# EAGLE design PhasedArray3 (EAGLE 9.5.2)
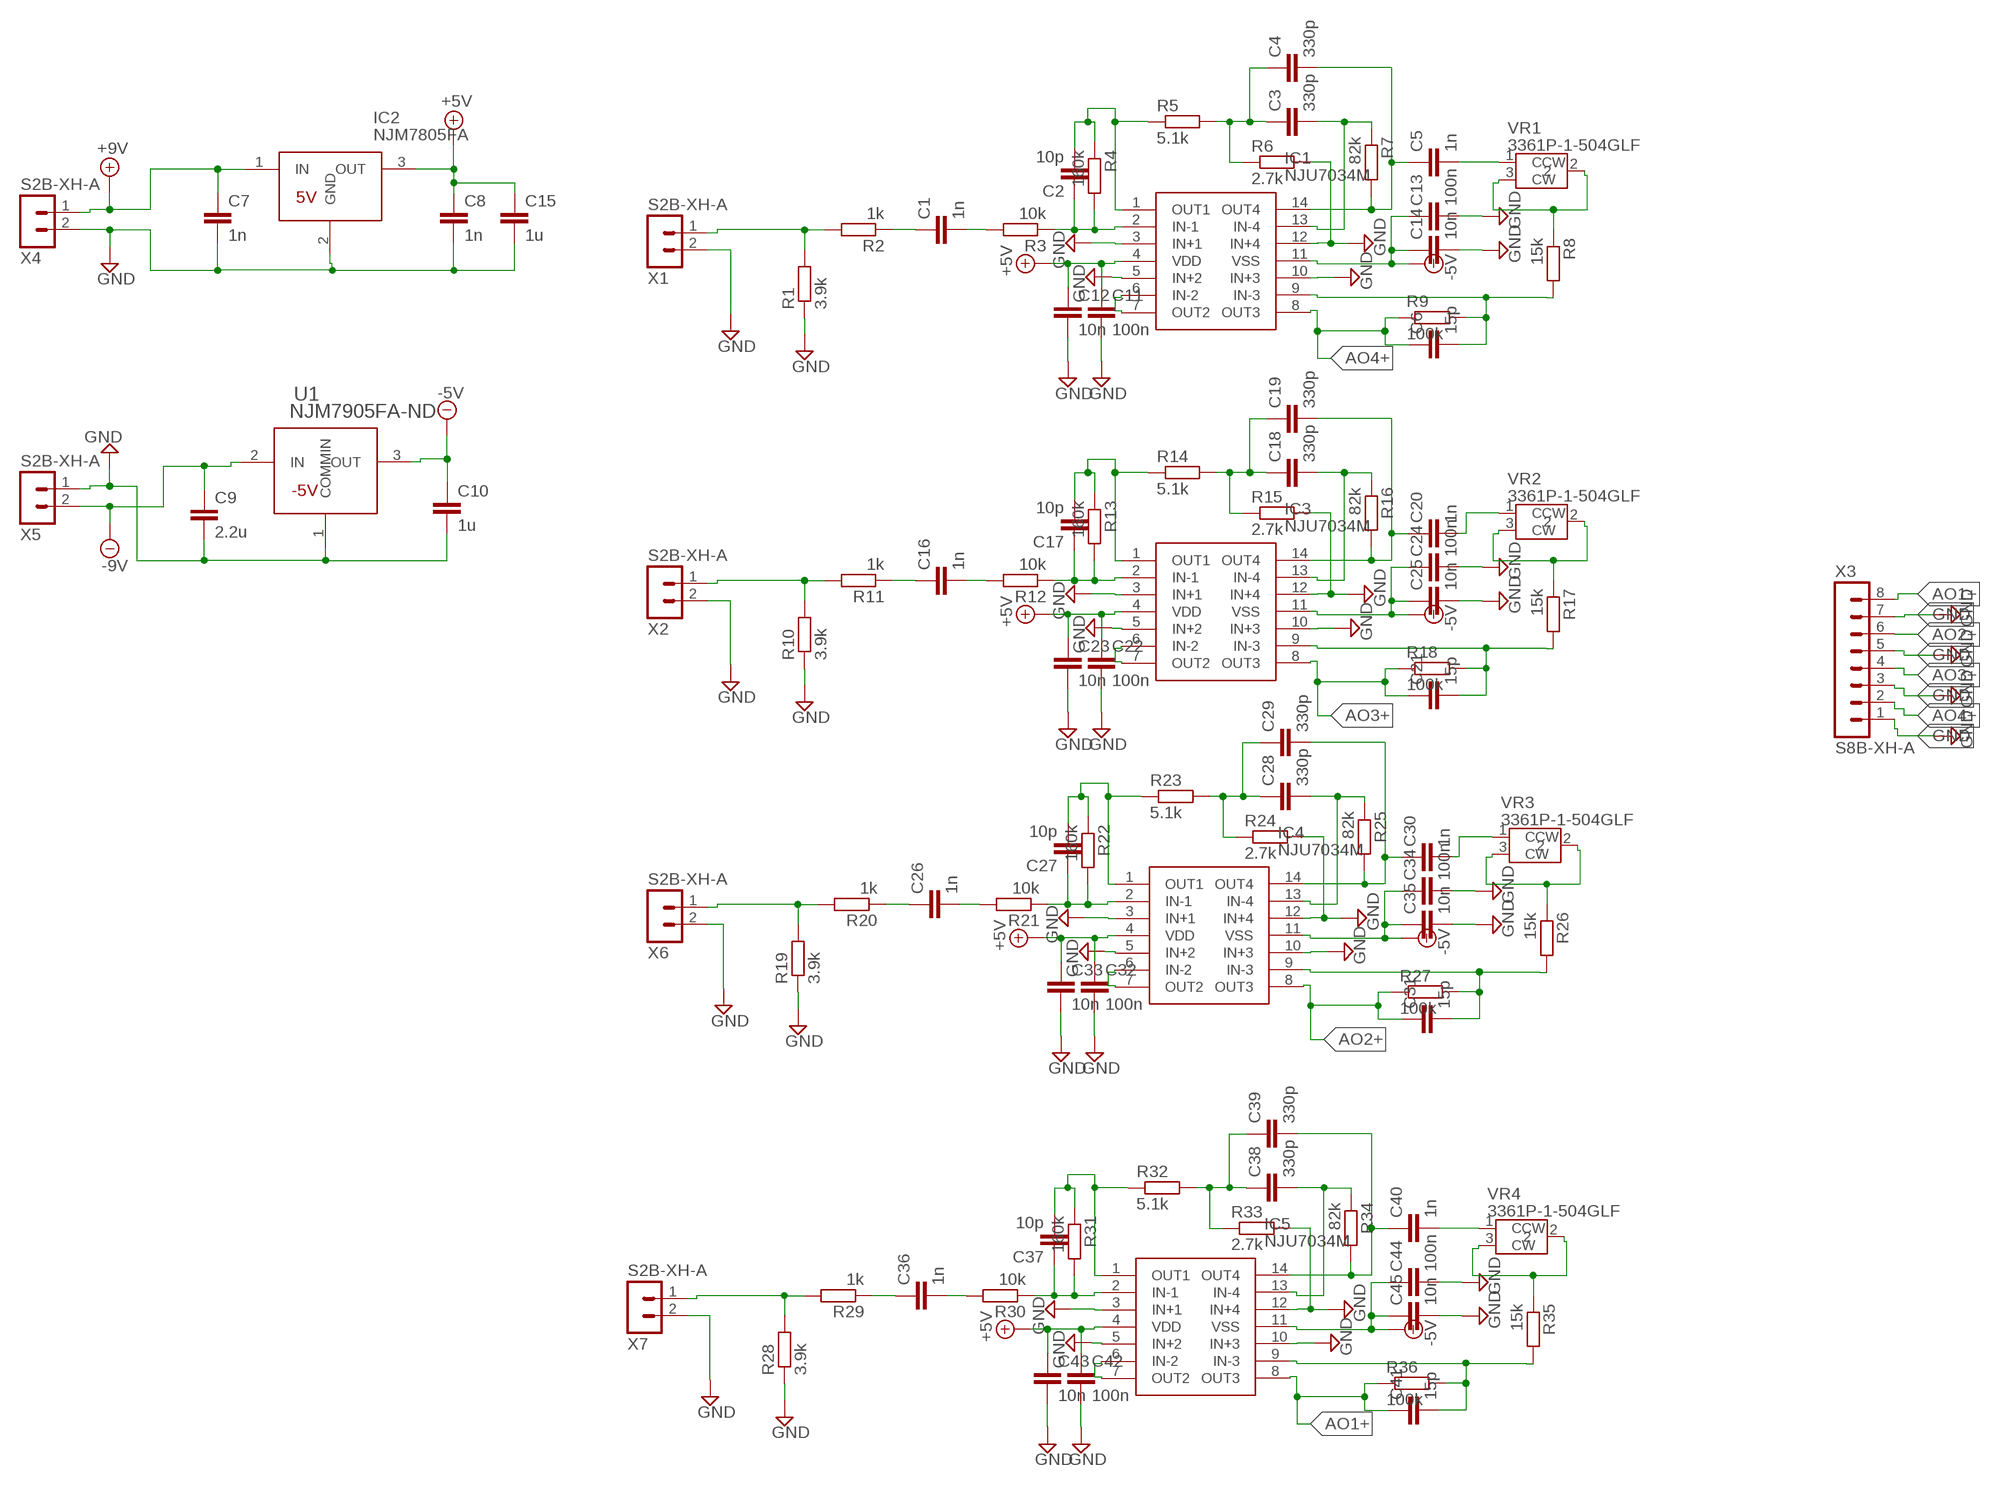
[diagram p0: schematic, sheet 1]

## Parts
C1  1n  C-EUC0603K  [C0603K]
C2  10p  C-EUC0603K  [C0603K]
C3  330p  C-EUC0603K  [C0603K]
C4  330p  C-EUC0603K  [C0603K]
C5  1n  C-EUC0603K  [C0603K]
C6  15p  C-EUC0603K  [C0603K]
C7  1n  C-EUC0603K  [C0603K]
C8  1n  C-EUC0603K  [C0603K]
C9  2.2u  C-EUC0805K  [C0805K]
C10  1u  C-EUC0805K  [C0805K]
C11  100n  C-EUC0603K  [C0603K]
C12  10n  C-EUC0603K  [C0603K]
C13  100n  C-EUC0603K  [C0603K]
C14  10n  C-EUC0603K  [C0603K]
C15  1u  C-EUC0805K  [C0805K]
C16  1n  C-EUC0603K  [C0603K]
C17  10p  C-EUC0603K  [C0603K]
C18  330p  C-EUC0603K  [C0603K]
C19  330p  C-EUC0603K  [C0603K]
C20  1n  C-EUC0603K  [C0603K]
C21  15p  C-EUC0603K  [C0603K]
C22  100n  C-EUC0603K  [C0603K]
C23  10n  C-EUC0603K  [C0603K]
C24  100n  C-EUC0603K  [C0603K]
C25  10n  C-EUC0603K  [C0603K]
C26  1n  C-EUC0603K  [C0603K]
C27  10p  C-EUC0603K  [C0603K]
C28  330p  C-EUC0603K  [C0603K]
C29  330p  C-EUC0603K  [C0603K]
C30  1n  C-EUC0603K  [C0603K]
C31  15p  C-EUC0603K  [C0603K]
C32  100n  C-EUC0603K  [C0603K]
C33  10n  C-EUC0603K  [C0603K]
C34  100n  C-EUC0603K  [C0603K]
C35  10n  C-EUC0603K  [C0603K]
C36  1n  C-EUC0603K  [C0603K]
C37  10p  C-EUC0603K  [C0603K]
C38  330p  C-EUC0603K  [C0603K]
C39  330p  C-EUC0603K  [C0603K]
C40  1n  C-EUC0603K  [C0603K]
C41  15p  C-EUC0603K  [C0603K]
C42  100n  C-EUC0603K  [C0603K]
C43  10n  C-EUC0603K  [C0603K]
C44  100n  C-EUC0603K  [C0603K]
C45  10n  C-EUC0603K  [C0603K]
IC1  NJU7034M  [SOIC127P680X175-14N]
IC2  NJM7805FA  [TO254P500X1000X2170-3P]
IC3  NJU7034M  [SOIC127P680X175-14N]
IC4  NJU7034M  [SOIC127P680X175-14N]
IC5  NJU7034M  [SOIC127P680X175-14N]
R1  3.9k  R-EU_R0603  [R0603]
R2  1k  R-EU_R0603  [R0603]
R3  10k  R-EU_R0603  [R0603]
R4  160k  R-EU_R0603  [R0603]
R5  5.1k  R-EU_R0603  [R0603]
R6  2.7k  R-EU_R0603  [R0603]
R7  82k  R-EU_R0603  [R0603]
R8  15k  R-EU_R0603  [R0603]
R9  100k  R-EU_R0603  [R0603]
R10  3.9k  R-EU_R0603  [R0603]
R11  1k  R-EU_R0603  [R0603]
R12  10k  R-EU_R0603  [R0603]
R13  160k  R-EU_R0603  [R0603]
R14  5.1k  R-EU_R0603  [R0603]
R15  2.7k  R-EU_R0603  [R0603]
R16  82k  R-EU_R0603  [R0603]
R17  15k  R-EU_R0603  [R0603]
R18  100k  R-EU_R0603  [R0603]
R19  3.9k  R-EU_R0603  [R0603]
R20  1k  R-EU_R0603  [R0603]
R21  10k  R-EU_R0603  [R0603]
R22  160k  R-EU_R0603  [R0603]
R23  5.1k  R-EU_R0603  [R0603]
R24  2.7k  R-EU_R0603  [R0603]
R25  82k  R-EU_R0603  [R0603]
R26  15k  R-EU_R0603  [R0603]
R27  100k  R-EU_R0603  [R0603]
R28  3.9k  R-EU_R0603  [R0603]
R29  1k  R-EU_R0603  [R0603]
R30  10k  R-EU_R0603  [R0603]
R31  160k  R-EU_R0603  [R0603]
R32  5.1k  R-EU_R0603  [R0603]
R33  2.7k  R-EU_R0603  [R0603]
R34  82k  R-EU_R0603  [R0603]
R35  15k  R-EU_R0603  [R0603]
R36  100k  R-EU_R0603  [R0603]
U1  NJM7905FA-ND  [NJR-TO-220F-3_NJR]
VR1  3361P-1-504GLF  [3361P1253GLF]
VR2  3361P-1-504GLF  [3361P1253GLF]
VR3  3361P-1-504GLF  [3361P1253GLF]
VR4  3361P-1-504GLF  [3361P1253GLF]
X1  S2B-XH-A  [S2B-XH-A]
X2  S2B-XH-A  [S2B-XH-A]
X3  S8B-XH-A  [S8B-XH-A]
X4  S2B-XH-A  [S2B-XH-A]
X5  S2B-XH-A  [S2B-XH-A]
X6  S2B-XH-A  [S2B-XH-A]
X7  S2B-XH-A  [S2B-XH-A]

## Nets
+5V: C8.1 C11.1 C12.1 C15.1 C22.1 C23.1 C32.1 C33.1 C42.1 C43.1 IC1.4(VDD) IC2.3(OUT) IC3.4(VDD) IC4.4(VDD) IC5.4(VDD)
+9V: C7.1 IC2.1(IN) X4.1
-5V: C10.1 C13.1 C14.1 C24.1 C25.1 C34.1 C35.1 C44.1 C45.1 IC1.11(VSS) IC3.11(VSS) IC4.11(VSS) IC5.11(VSS) U1.3(OUT)
-9V: C9.1 U1.2(IN) X5.2
AO1+: C41.1 IC5.8(OUT3) R36.1 X3.8
AO2+: C31.1 IC4.8(OUT3) R27.1 X3.6
AO3+: C21.1 IC3.8(OUT3) R18.1 X3.4
AO4+: C6.1 IC1.8(OUT3) R9.1 X3.2
GND: C7.2 C8.2 C9.2 C10.2 C11.2 C12.2 C13.2 C14.2 C15.2 C22.2 C23.2 C24.2 C25.2 C32.2 C33.2 C34.2 C35.2 C42.2 C43.2 C44.2 C45.2 IC1.3(IN+1) IC1.5(IN+2) IC1.10(IN+3) IC1.12(IN+4) IC2.2(GND) IC3.3(IN+1) IC3.5(IN+2) IC3.10(IN+3) IC3.12(IN+4) IC4.3(IN+1) IC4.5(IN+2) IC4.10(IN+3) IC4.12(IN+4) IC5.3(IN+1) IC5.5(IN+2) IC5.10(IN+3) IC5.12(IN+4) R1.1 R6.2 R10.1 R15.2 R19.1 R24.2 R28.1 R33.2 U1.1(COMMIN) X1.2 X2.2 X3.1 X3.3 X3.5 X3.7 X4.2 X5.1 X6.2 X7.2
N$1: R1.2 R2.2 X1.1
N$2: C1.1 R2.1
N$3: C2.2 IC1.1(OUT1) R4.1 R5.1
N$4: C1.2 R3.2
N$5: C2.1 IC1.2(IN-1) R3.1 R4.2
N$6: C3.1 C4.1 R5.2 R6.1
N$7: C4.2 C5.1 IC1.14(OUT4) R7.2
N$8: C3.2 IC1.13(IN-4) R7.1
N$10: C5.2 VR1.1(CCW)
N$11: C6.2 IC1.9(IN-3) R8.2 R9.2
N$12: R8.1 VR1.2 VR1.3(CW)
N$13: IC1.6(IN-2) IC1.7(OUT2)
N$14: R10.2 R11.2 X2.1
N$15: C16.1 R11.1
N$16: C16.2 R12.2
N$17: C17.1 IC3.2(IN-1) R12.1 R13.2
N$18: C17.2 IC3.1(OUT1) R13.1 R14.1
N$19: C18.1 C19.1 R14.2 R15.1
N$20: C18.2 IC3.13(IN-4) R16.1
N$21: C19.2 C20.1 IC3.14(OUT4) R16.2
N$22: C21.2 IC3.9(IN-3) R17.2 R18.2
N$24: C20.2 VR2.1(CCW)
N$25: R17.1 VR2.2 VR2.3(CW)
N$26: IC3.6(IN-2) IC3.7(OUT2)
N$27: R19.2 R20.2 X6.1
N$28: C26.1 R20.1
N$29: C26.2 R21.2
N$30: C27.1 IC4.2(IN-1) R21.1 R22.2
N$31: C27.2 IC4.1(OUT1) R22.1 R23.1
N$32: C28.1 C29.1 R23.2 R24.1
N$33: C28.2 IC4.13(IN-4) R25.1
N$34: C29.2 C30.1 IC4.14(OUT4) R25.2
N$35: C31.2 IC4.9(IN-3) R26.2 R27.2
N$37: C30.2 VR3.1(CCW)
N$38: R26.1 VR3.2 VR3.3(CW)
N$39: IC4.6(IN-2) IC4.7(OUT2)
N$40: R28.2 R29.2 X7.1
N$41: C36.1 R29.1
N$42: C36.2 R30.2
N$43: C37.1 IC5.2(IN-1) R30.1 R31.2
N$44: C37.2 IC5.1(OUT1) R31.1 R32.1
N$45: C38.1 C39.1 R32.2 R33.1
N$46: C38.2 IC5.13(IN-4) R34.1
N$47: C39.2 C40.1 IC5.14(OUT4) R34.2
N$48: C41.2 IC5.9(IN-3) R35.2 R36.2
N$50: C40.2 VR4.1(CCW)
N$51: R35.1 VR4.2 VR4.3(CW)
N$52: IC5.6(IN-2) IC5.7(OUT2)

## Library data of the parts
C1-C45 = rcl:C-EU: CAPACITOR, European symbol; SPICEPREFIX: C
IC1 IC3-IC5 = SamacSys_Parts:NJU7034M: General Purpose Amplifier 4 Circuit Rail-to-Rail 14-DMP Source: Datasheet <http://www.njr.com/semicon/PDF/NJU7031_NJU7032_NJU7034_E.pdf>; DESCRIPTION: General Purpose Amplifier 4 Circuit Rail-to-Rail 14-DMP; HEIGHT: 1.75mm; MANUFACTURER_NAME: New Japan Radio; MANUFACTURER_PART_NUMBER: NJU7034M; MOUSER_PART_NUMBER: 513-NJU7034M; MOUSER_PRICE-STOCK: https://www.mouser.co.uk/ProductDetail/NJR/NJU7034M?qs=h19x94Mol3yfUbOiRzvEIQ%3D%3D
IC2 = NJM7805FA:NJM7805FA: Linear Voltage Regulators 5V 1.5A 3 Terminal Source: Datasheet <http://www.njr.com/semicon/PDF/NJM7800_E.pdf>; DESCRIPTION: Linear Voltage Regulators 5V 1.5A 3 Terminal; HEIGHT: 5mm; MANUFACTURER_NAME: NJR; MANUFACTURER_PART_NUMBER: NJM7805FA; MOUSER_PART_NUMBER: 513-NJM7805FA; MOUSER_PRICE-STOCK: https://www.mouser.co.uk/ProductDetail/NJR/NJM7805FA?qs=Z22AoiKME3MfSV1RpQcPCA%3D%3D
R1-R36 = rcl:R-EU_: RESISTOR, European symbol; SPICEPREFIX: R
U1 = NJM7905FA:NJM7905FA-ND; BUILT_BY: EMA_UL_Team; MANUFACTURER_PART_NUMBER: NJM7905FA-ND; SOURCELIBRARY: NJR_2014-15-09; VENDOR: NJR
VR1-VR4 = 3361P-1-504GLF:3361P-1-504GLF: BOURNS - 3361P-1-504GLF - Product Range:AEC-Q200 3361P Series Source: Datasheet <https://www.bourns.com/docs/Product-Datasheets/3361.pdf>; DESCRIPTION: BOURNS - 3361P-1-504GLF - Product Range:AEC-Q200 3361P Series; HEIGHT: 5.84mm; MANUFACTURER_NAME: Bourns; MANUFACTURER_PART_NUMBER: 3361P-1-504GLF; MOUSER_PART_NUMBER: 652-3361P-1-504GLF; MOUSER_PRICE-STOCK: https://www.mouser.co.uk/ProductDetail/Bourns/3361P-1-504GLF?qs=fqIB%2FsSTfTaKxcvNNIdl2Q%3D%3D
X1 X2 X4-X7 = con-JST XH:S2B-XH: JST XH series header 2.50mm pitch disconnectable crimp style connectors, horizontal (side entry type), 2 pins
X3 = con-JST XH:S8B-XH: JST XH series header 2.50mm pitch disconnectable crimp style connectors, horizontal (side entry type), 8 pins

## Net classes
0 default: clearance 0.508 mm

## Board
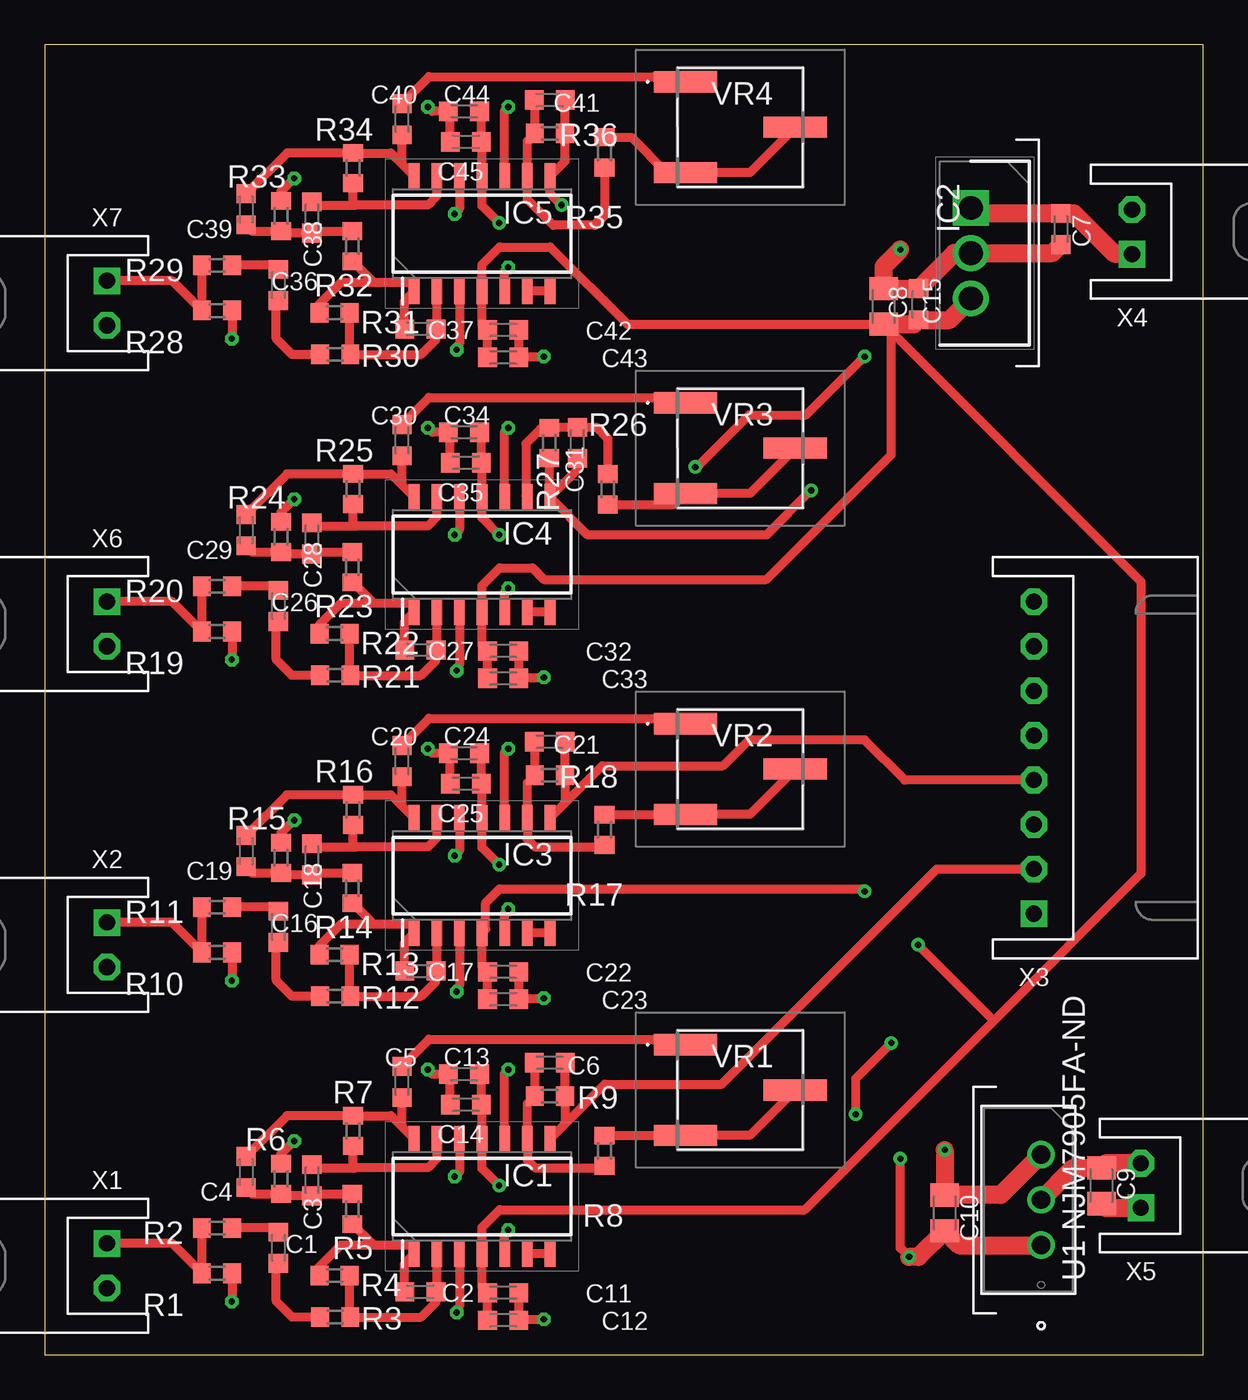
[diagram p1: board, top side]
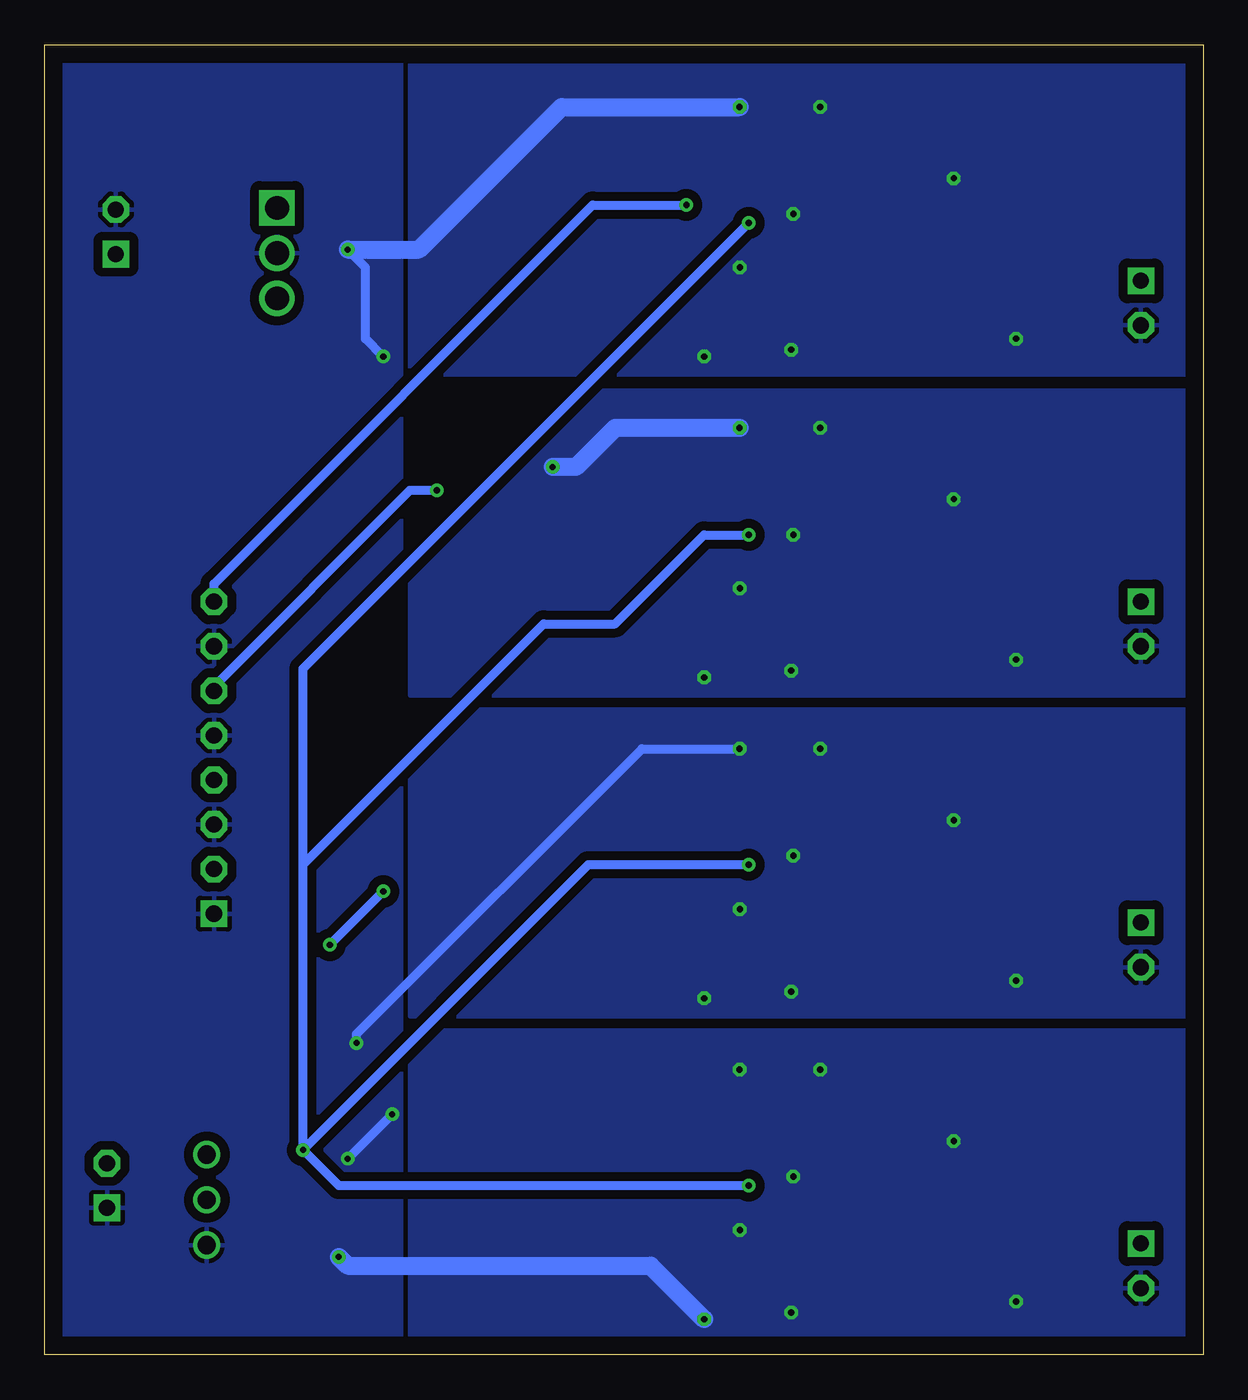
[diagram p2: board, bottom side, seen from below]

Size 65 x 73.5 mm. Coordinates in mm from the lower left corner, seen from the top.
Outline: 0,0 65,0 65,73.5 0,73.5 0,0
Copper layers (1*16): Top 0.035mm / dielectric 1.5mm / Bottom 0.035mm
Design rules "default": minimum track width 6mil, minimum drill 0.35mm, track to track 6mil, track to pad 6mil, pad to pad 6mil, via to via 6mil, smd to smd 6mil, copper to edge 40mil, drill to drill 6mil, minimum pad ring 10mil, minimum via ring 8mil, stop-mask expansion 4mil, vias tented up to drill 0mil, thermal gap 10mil

### Footprints (pad centres in the part's own frame; a part is rotated, then mirrored left to right if it is on the bottom)
C0603K = smd 1.05 x 1.08: 1 -0.875,0; 2 0.875,0
C0805K = smd 1.3 x 1.6: 1 -1,0; 2 1,0
SOIC127P680X175-14N = smd 1.45 x 0.6: 1 -3.225,3.81; 2 -3.225,2.54; 3 -3.225,1.27; 4 -3.225,0; 5 -3.225,-1.27; 6 -3.225,-2.54; 7 -3.225,-3.81; 8 3.225,-3.81; 9 3.225,-2.54; 10 3.225,-1.27; 11 3.225,0; 12 3.225,1.27; 13 3.225,2.54; 14 3.225,3.81
TO254P500X1000X2170-3P = drill 1.33 pad 1.995 square: 1 0,0 | drill 1.33 pad 1.995: 2 2.54,0; 3 5.08,0
R0603 = smd 1 x 1.1: 1 -0.85,0; 2 0.85,0
NJR-TO-220F-3_NJR = drill 1.016 pad 1.524: 1 0,0; 2 2.54,0; 3 5.08,0
3361P1253GLF = smd 1.19 x 3.55: 1 -2.54,-3.075; 2 0,3.075; 3 2.54,-3.075
S2B-XH-A = drill 0.9 pad 1.5 square: 1 1.25,0 | drill 0.9 pad 1.5 octagon: 2 -1.25,0
S8B-XH-A = drill 0.9 pad 1.5 square: 1 8.75,0 | drill 0.9 pad 1.5 octagon: 2 6.25,0; 3 3.75,0; 4 1.25,0; 5 -1.25,0; 6 -3.75,0; 7 -6.25,0; 8 -8.75,0

### Placement (x,y rotation side)
C1  13.12,6.01 270 top
C2  21.08,3.54 180 top
C3  15,9.8 90 top
C4  11.31,10.26 90 top
C5  20.05,15.31 90 top
C6  28.34,16.39 180 top
C7  57.01,63.15 270 top
C8  49.03,58.93 90 top
C9  59.28,9.49 270 top
C10  50.49,7.97 270 top
C11  25.73,3.49 0 top
C12  25.73,1.95 0 top
C13  23.53,15.75 180 top
C14  23.63,14.04 180 top
C15  47.07,58.81 90 top
C16  13.12,24.01 270 top
C17  21.08,21.54 180 top
C18  15,27.8 90 top
C19  11.31,28.26 90 top
C20  20.05,33.31 90 top
C21  28.34,34.39 180 top
C22  25.73,21.49 0 top
C23  25.73,19.95 0 top
C24  23.53,33.75 180 top
C25  23.63,32.04 180 top
C26  13.12,42.01 270 top
C27  21.08,39.54 180 top
C28  15,45.8 90 top
C29  11.31,46.26 90 top
C30  20.05,51.31 90 top
C31  29.89,51.16 90 top
C32  25.73,39.49 0 top
C33  25.73,37.95 0 top
C34  23.53,51.75 180 top
C35  23.63,50.04 180 top
C36  13.12,60.01 270 top
C37  21.08,57.54 180 top
C38  15,63.8 90 top
C39  11.31,64.26 90 top
C40  20.05,69.31 90 top
C41  28.34,70.39 180 top
C42  25.73,57.49 0 top
C43  25.73,55.95 0 top
C44  23.53,69.75 180 top
C45  23.63,68.04 180 top
IC1  24.54,8.89 90 top
IC2  51.96,64.34 270 top
IC3  24.54,26.89 90 top
IC4  24.54,44.89 90 top
IC5  24.54,62.89 90 top
R1  9.68,4.58 180 top
R2  9.68,7.12 180 top
R3  16.3,2.12 180 top
R4  16.27,4.46 0 top
R5  17.27,8.19 90 top
R6  13.27,9.88 90 top
R7  17.31,12.57 90 top
R8  31.41,11.45 270 top
R9  28.35,14.51 180 top
R10  9.68,22.58 180 top
R11  9.68,25.12 180 top
R12  16.3,20.12 180 top
R13  16.27,22.46 0 top
R14  17.27,26.19 90 top
R15  13.27,27.88 90 top
R16  17.31,30.57 90 top
R17  31.41,29.45 270 top
R18  28.35,32.51 180 top
R19  9.68,40.58 180 top
R20  9.68,43.12 180 top
R21  16.3,38.12 180 top
R22  16.27,40.46 0 top
R23  17.27,44.19 90 top
R24  13.27,45.88 90 top
R25  17.31,48.57 90 top
R26  31.59,48.55 90 top
R27  28.31,51.15 90 top
R28  9.68,58.58 180 top
R29  9.68,61.12 180 top
R30  16.3,56.12 180 top
R31  16.27,58.46 0 top
R32  17.27,62.19 90 top
R33  13.27,63.88 90 top
R34  17.31,66.57 90 top
R35  31.41,67.45 270 top
R36  28.35,68.51 180 top
U1  55.9,6.16 90 top
VR1  39.03,14.86 270 top
VR2  39.03,32.86 270 top
VR3  39.03,50.86 270 top
VR4  39.03,68.86 270 top
X1  3.5,5 90 top
X2  3.5,23 90 top
X3  55.5,33.5 270 top
X4  61,63 270 top
X5  61.5,9.5 270 top
X6  3.5,41 90 top
X7  3.5,59 90 top

### Tracks (layer width: path | path; a pad name or v marks a point on that pad's centre or on a via)
+5V  (via drill 0.35)
  Top 0.508: C12.1 C11.1 24.54,3.81 IC1.4 24.54,7.15 25.53,8.14 42.64,8.14 53.25,18.75 | C23.1 C22.1 24.54,21.8 IC3.4 24.75,23.87 24.75,25.36 25.53,26.14 45.86,26.14 v46,26 | C33.1 C32.1 24.54,39.8 IC4.4 24.54,43.15 25.53,44.14 27.36,44.14 28,43.5 40.5,43.5 47.5,50.5 47.5,57.38 C15.1 | C43.1 C42.1 24.54,57.8 IC5.4 24.54,61.15 25.53,62.14 28.36,62.14 32.69,57.81 C15.1 | 53.25,18.75 61.5,27 61.5,43.38 C15.1 | v49,23 53.25,18.75
  Top 1.016: C15.1 48.78,57.81 C8.1 50.76,58.05 IC2.3
  Bottom 0.508: v46,26 v49,23
+9V
  Top 1.016: IC2.1 52.27,64.03 C7.1 57.76,64.03 60.04,61.75 X4.1
-5V  (via drill 0.35)
  Top 0.508: C13.1 24.5,15.65 C14.1 24.54,14.04 IC1.11 24.54,10.46 v25.5,9.5 | C24.1 24.5,33.65 C25.1 24.54,32.04 IC3.11 24.54,28.46 v25.5,27.5 | C34.1 24.5,51.65 C35.1 24.54,50.04 IC4.11 24.54,46.96 v25.5,46 | C44.1 24.5,69.65 C45.1 24.54,68.04 IC5.11 24.54,64.46 v25.5,63.5
  Top 1.016: U1.3 53.63,8.97 C10.1 v50.49,11.49 v50.5,11.5
  Bottom 0.508: v50.5,11.5 48.5,9.5 v25.5,9.5 | v50.5,11.5 34.5,27.5 v25.5,27.5 | v50.5,11.5 50.5,27.5 | 50.5,27.5 37,41 33,41 28,46 v25.5,46 | 50.5,27.5 50.5,38.5 v25.5,63.5
-9V
  Top 1.016: X5.2 59.54,10.75 C9.1 57.69,10.49 U1.2
AO1+  (via drill 0.35)
  Top 0.508: C41.1 29.2,70.38 R36.1 29.2,66.97 IC5.8 28.35,65.15 v29,64.5
  Bottom 0.508: X3.8 55.5,43.25 34.25,64.5 v29,64.5
AO2+  (via drill 0.35)
  Top 0.508: IC4.8 30.46,46 40.5,46 v43,48.5 | R27.1 28.31,48.16 IC4.8 | IC4.8 29.89,49.66 C31.1
  Bottom 0.508: X3.6 55.5,37.5 44.5,48.5 v43,48.5
AO3+
  Top 0.508: IC3.8 29.2,30.96 | 29.2,30.96 R18.1 29.2,34.38 C21.1 | 29.2,30.96 31.28,33.04 38.05,33.04 39.5,34.5 46,34.5 48.25,32.25 X3.4
AO4+
  Top 0.508: IC1.8 29.2,12.96 | 29.2,12.96 R9.1 29.2,16.38 C6.1 | 29.2,12.96 31.41,15.18 37.97,15.18 50.05,27.25 X3.2
GND  (via drill 0.35)
  Top 0.508: R1.1 10.53,3 v10.5,3 | R6.2 13.27,11.27 v14,12 | C11.2 C12.2 26.66,2 v28,2 | IC1.3 23.27,2.71 23.03,2.47 v23.12,2.38 | IC1.10 25.81,15.81 26,16 v26.02,16 | C14.2 22.75,15.65 C13.2 21.75,15.75 v21.5,16 | IC1.12 23.27,10.27 v23,10 | IC1.5 25.81,6.81 v26,7 | R10.1 10.53,21 v10.5,21 | R15.2 13.27,29.27 v14,30 | C22.2 C23.2 26.66,20 v28,20 | IC3.3 23.27,20.71 23.03,20.47 v23.12,20.38 | IC3.10 25.81,33.81 26,34 v26.02,34 | C25.2 22.75,33.65 C24.2 21.75,33.75 v21.5,34 | IC3.12 23.27,28.27 v23,28 | IC3.5 25.81,24.81 v26,25 | R19.1 10.53,39 v10.5,39 | R24.2 13.27,47.27 v14,48 | C32.2 C33.2 26.66,38 v28,38 | IC4.3 23.27,38.71 23.03,38.47 v23.12,38.38 | IC4.10 25.81,51.81 26,52 v26.02,52 | C35.2 22.75,51.65 C34.2 21.75,51.75 v21.5,52 | IC4.12 23.27,46.27 v23,46 | IC4.5 25.81,42.81 v26,43 | R28.1 10.53,57 v10.5,57 | R33.2 13.27,65.27 v14,66 | C42.2 C43.2 26.66,56 v28,56 | IC5.3 23.27,56.71 23.03,56.47 v23.12,56.38 | IC5.10 25.81,69.81 26,70 v26.02,70 | C45.2 22.75,69.65 C44.2 21.75,69.75 v21.5,70 | IC5.12 23.27,64.27 v23,64 | IC5.5 25.81,60.81 v26,61 | v36.5,49.8 36.6,49.8 39.51,52.72 42.72,52.72 v46,56 | v48.5,5.5 48,6 v48,11 | v45.5,13.5 45.5,15.5 v47.5,17.5
  Top 1.016: C7.2 56.53,61.8 IC2.2 51.02,61.8 C8.2 C15.2 47.07,61.07 v48,62 | U1.1 51.3,6.16 C10.2 49.02,5.5 v48.5,5.5 | C9.2 59.52,8.25 X5.1
  Bottom 0.508: v23.12,2.38 23,2.5 | v26.02,16 26,16 | v23.12,20.38 23,20.5 | 26,34 v26.02,34 31.5,34 47.5,18 v47.5,17.5 | v23.12,38.38 23,38.5 | v26.02,52 26,52 | v23.12,56.38 23,56.5 | v26.02,70 26,70 | v46,56 47,57 47,61 v48,62 | v48,11 v45.5,13.5
  Bottom 1.016: v48,62 44,62 36,70 v26.02,70 | v48.5,5.5 48,5 31,5 v28,2 | v26.02,52 33,52 35.2,49.8 v36.5,49.8
  pour Bottom: 44.5,1 0,1 0,18.2 44.5,18.2
  pour Bottom: 44.5,19 0,19 0,36.2 44.5,36.2
  pour Bottom: 44.5,37 0,37 0,54.1 44.5,54.1
  pour Bottom: 44.5,55 0,55 0,72.7 44.5,72.7
  pour Bottom: 45,73.5 65,73.5 65,0 45,0
  pour Bottom: 47,59.5 47,60.5 48,61.5
N$1
  Top 0.508: R2.2 R1.2 7.16,6.25 X1.1
N$2
  Top 0.508: C1.1 12.88,7.12 R2.1
N$3
  Top 0.508: C2.2 20.2,5.14 IC1.1 20.73,5.88 20.45,6.17 18.45,6.17 | R5.1 18.45,6.17 | R4.1 15.42,4.96 16.62,6.17 18.45,6.17
N$4
  Top 0.508: R3.2 13.88,2.12 13,3 13,5.01 C1.2
N$5
  Top 0.508: IC1.2 22,3.58 C2.1 21.95,2.96 21.12,2.12 R3.1 17.12,2.15 R4.2
N$6
  Top 0.508: R5.2 15.12,9.04 C3.1 13.38,8.93 R6.1 11.66,9.03 C4.1
N$7
  Top 0.508: C4.2 13.6,13.42 R7.2 19.43,13.42 20.05,12.79 | IC1.14 20.05,12.79 | 20.05,12.79 C5.1
N$8
  Top 0.508: IC1.13 22,11 21.5,10.5 17.5,10.5 | 17.5,10.5 17.31,10.69 R7.1 | C3.2 15.18,10.5 17.5,10.5
N$10
  Top 0.508: C5.2 21.57,17.7 34.2,17.7 34.5,17.4 VR1.1
N$11
  Top 0.508: C6.2 27.5,16.36 R9.2 27.08,14.09 IC1.9 27.08,10.92 27.5,10.5 31.31,10.5 R8.2
N$12
  Top 0.508: VR1.2 39.56,12.32 VR1.3 31.43,12.32 R8.1
N$13
  Top 0.508: IC1.7 IC1.6
N$14
  Top 0.508: R11.2 R10.2 7.16,24.25 X2.1
N$15
  Top 0.508: C16.1 12.88,25.12 R11.1
N$16
  Top 0.508: R12.2 13.88,20.12 13,21 13,23.02 C16.2
N$17
  Top 0.508: IC3.2 22,21.59 C17.1 21.95,20.95 21.12,20.12 R12.1 17.12,20.15 R13.2
N$18
  Top 0.508: C17.2 20.2,23.14 IC3.1 20.73,23.88 20.45,24.16 18.45,24.16 | R14.1 18.45,24.16 | R13.1 15.42,22.96 16.62,24.16 18.45,24.16
N$19
  Top 0.508: R14.2 15.12,27.04 C18.1 13.38,26.93 R15.1 11.66,27.03 C19.1
N$20
  Top 0.508: IC3.13 22,29 21.5,28.5 17.5,28.5 | 17.5,28.5 17.31,28.69 R16.1 | C18.2 15.18,28.5 17.5,28.5
N$21
  Top 0.508: C19.2 13.6,31.42 R16.2 19.43,31.42 20.05,30.8 | IC3.14 20.05,30.8 | 20.05,30.8 C20.1
N$22
  Top 0.508: C21.2 27.5,34.35 R18.2 27.08,32.09 IC3.9 27.08,28.92 27.5,28.5 31.31,28.5 R17.2
N$24
  Top 0.508: C20.2 21.57,35.7 34.2,35.7 34.5,35.4 VR2.1
N$25
  Top 0.508: VR2.2 39.56,30.32 VR2.3 31.43,30.32 R17.1
N$26
  Top 0.508: IC3.7 IC3.6
N$27
  Top 0.508: R20.2 R19.2 7.16,42.25 X6.1
N$28
  Top 0.508: C26.1 12.88,43.12 R20.1
N$29
  Top 0.508: R21.2 13.88,38.12 13,39 13,41.02 C26.2
N$30
  Top 0.508: IC4.2 22,39.59 C27.1 21.95,38.95 21.12,38.12 R21.1 17.12,38.15 R22.2
N$31
  Top 0.508: C27.2 20.2,41.14 IC4.1 20.73,41.88 20.45,42.16 18.45,42.16 | R23.1 18.45,42.16 | R22.1 15.42,40.96 16.62,42.16 18.45,42.16
N$32
  Top 0.508: R23.2 15.12,45.04 C28.1 13.38,44.92 R24.1 11.66,45.03 C29.1
N$33
  Top 0.508: IC4.13 22,47 21.5,46.5 17.5,46.5 | 17.5,46.5 17.31,46.69 R25.1 | C28.2 15.18,46.5 17.5,46.5
N$34
  Top 0.508: C29.2 13.6,49.42 R25.2 19.43,49.42 20.05,48.8 | IC4.14 20.05,48.8 | 20.05,48.8 C30.1
N$35
  Top 0.508: IC4.9 27,48.2 27,51.12 27.84,51.96 28.27,51.96 R27.2 28.34,52.03 C31.2 30.96,52.03 31.59,51.41 R26.2
N$37
  Top 0.508: C30.2 21.57,53.7 34.2,53.7 34.5,53.4 VR3.1
N$38
  Top 0.508: VR3.2 39.56,48.32 VR3.3 35.34,47.7 R26.1
N$39
  Top 0.508: IC4.7 IC4.6
N$40
  Top 0.508: R29.2 R28.2 7.16,60.25 X7.1
N$41
  Top 0.508: C36.1 12.88,61.12 R29.1
N$42
  Top 0.508: R30.2 13.88,56.12 13,57 13,59.02 C36.2
N$43
  Top 0.508: IC5.2 22,57.59 C37.1 21.95,56.95 21.12,56.12 R30.1 17.12,56.15 R31.2
N$44
  Top 0.508: C37.2 20.2,59.14 IC5.1 20.73,59.88 20.45,60.16 18.45,60.16 | R32.1 18.45,60.16 | R31.1 15.42,58.96 16.62,60.16 18.45,60.16
N$45
  Top 0.508: R32.2 15.12,63.04 C38.1 13.38,62.92 R33.1 11.66,63.03 C39.1
N$46
  Top 0.508: IC5.13 22,65 21.5,64.5 17.5,64.5 | 17.5,64.5 17.31,64.69 R34.1 | C38.2 15.18,64.5 17.5,64.5
N$47
  Top 0.508: C39.2 13.6,67.42 R34.2 19.43,67.42 20.05,66.8 | IC5.14 20.05,66.8 | 20.05,66.8 C40.1
N$48
  Top 0.508: C41.2 27.5,70.36 R36.2 27.08,68.09 IC5.9 27.09,64.8 28.53,63.36 30.86,63.36 31.41,63.91 R35.2 31.31,66.5
N$50
  Top 0.508: C40.2 21.57,71.7 34.2,71.7 34.5,71.4 VR4.1
N$51
  Top 0.508: VR4.2 39.56,66.32 VR4.3 34.89,66.32 32.91,68.3 R35.1
N$52
  Top 0.508: IC5.7 IC5.6